# EAGLE design BlinkyBall (EAGLE 7.1.0)
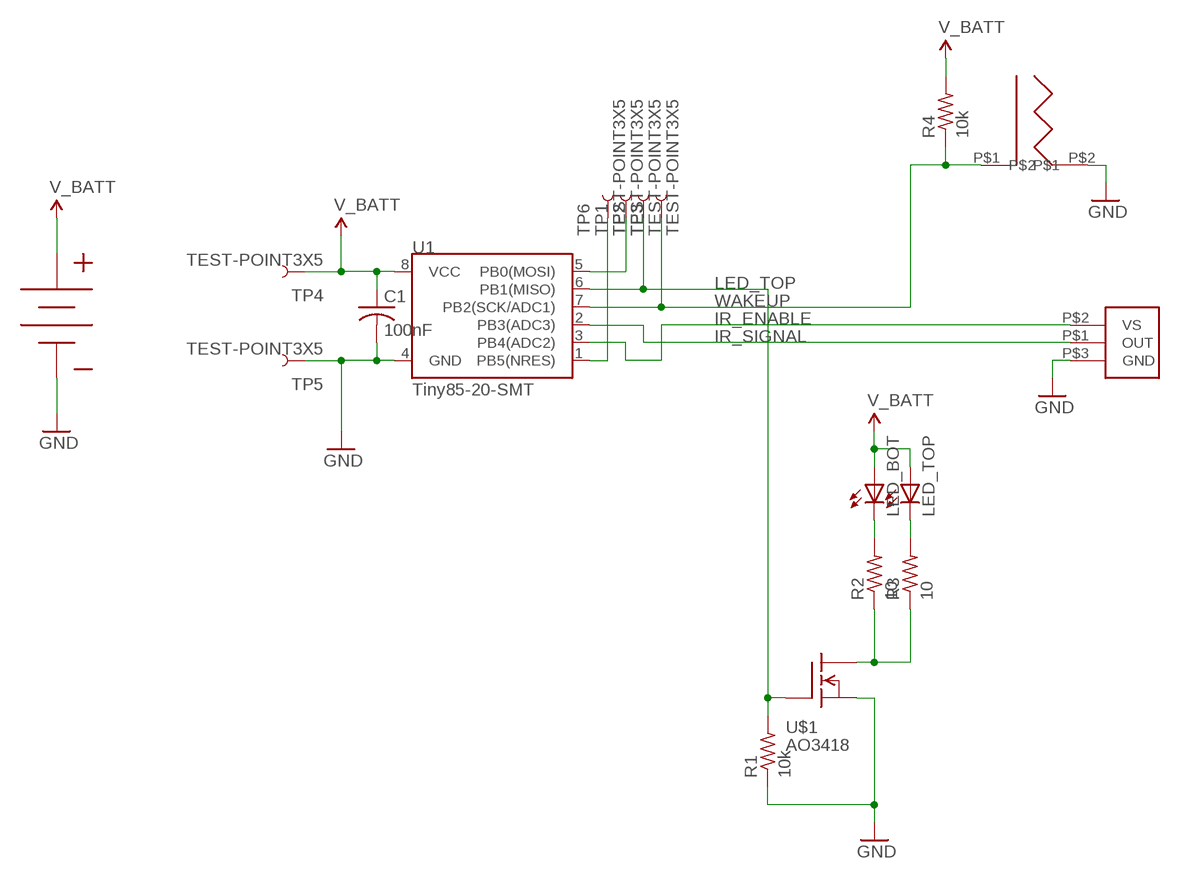
[diagram p0: schematic, sheet 1]

## Parts
C1  100nF  C-USC0603  [C0603]
LED_BOT  LED5MM  [LED5MM]
LED_TOP  LED5MM  [LED5MM]
R1  10k  R-US_R0603  [R0603]
R2  10  R-US_R0603  [R0603]
R3  10  R-US_R0603  [R0603]
R4  10k  R-US_R0603  [R0603]
TP1  TEST-POINT3X5  [PAD.03X.05]
TP2  TEST-POINT3X5  [PAD.03X.05]
TP3  TEST-POINT3X5  [PAD.03X.05]
TP4  TEST-POINT3X5  [PAD.03X.05]
TP5  TEST-POINT3X5  [PAD.03X.05]
TP6  TEST-POINT3X5  [PAD.03X.05]
U1  Tiny85-20-SMT  ATTINY45TINY85-20-SMT  [SO08-EIAJ]
U$1  AO3418  N_MOSFETSOT23  [SOT23]
U$2  BATTERY_BUTTON_CELLAG3  [BATTERY_COVER_AG3]
U$3  SW-18015P  [SW-18015P]
U$5  TSOP321  [TSOP321]

## Nets
GND: C1.2 R1.1 TP5.P$1 U1.4(GND) U$1.2(S) U$2.- U$3.P$2 U$5.P$3(GND)
IR_ENABLE: U1.3(PB4(ADC2)) U$5.P$2(VS)
IR_SIGNAL: U1.2(PB3(ADC3)) U$5.P$1(OUT)
LED_TOP: R1.2 TP2.P$1 U1.6(PB1(MISO)) U$1.1(G)
N$2: LED_BOT.K(C) R2.2
N$3: LED_TOP.K(C) R3.2
N$4: R2.1 R3.1 U$1.3(D)
RESET: TP6.P$1 U1.1(PB5(NRES))
V_BATT: C1.1 LED_BOT.A LED_TOP.A R4.2 TP4.P$1 U1.8(VCC) U$2.+1(+) U$2.+2(+) U$2.+3(+) U$2.+4(+)
WAKEUP: R4.1 TP3.P$1 U1.7(PB2(SCK/ADC1)) U$3.P$1
YYYYY: TP1.P$1 U1.5(PB0(MOSI))

## Library data of the parts
C1 = adafruit:C-US: CAPACITOR, American symbol
LED_BOT LED_TOP = adafruit:LED: LED OSRAM: - CHIPLED LG R971, LG N971, LY N971, LG Q971, LY Q971, LO R971, LY R971 LH N974, LH R974 LS Q976, LO Q976, LY Q976 LO Q996 - Hyper CHIPLED LW Q18S LB Q993, LB Q99A, LB R99A - SideLED LS A670, LO A670, LY A670, LG A670, LP A670 LB A673, LV A673, LT A673, LW A673 LH A674 LY A675 LS A676, LA A676, LO A676, LY A676, LW A676 LS A679, LY A679, LG A679 - Hyper Micro SIDELED® LS Y876, LA Y876, LO Y876, LY Y876 LT Y87S - SmartLED LW L88C, LW L88S LB L89C, LB L89S, LG L890 LS L89K, LO L89K, LY L89K LS L896, LA L896, LO L896, LY L896 - TOPLED LS T670, LO T670, LY T670, LG T670, LP T670 LSG T670, LSP T670, LSY T670, LOP T670, LYG T670 LG T671, LOG T671, LSG T671 LB T673, LV T673, LT T673, LW T673 LH T674 LS T676, LA T676, LO T676, LY T676, LB T676, LH T676, LSB T676, LW T676 LB T67C, LV T67C, LT T67C, LS T67K, LO T67K, LY T67K, LW E67C LS E67B, LA E67B, LO E67B, LY E67B, LB E67C, LV E67C, LT E67C LW T67C LS T679, LY T679, LG T679 LS T770, LO T770, LY T770, LG T770, LP T770 LB T773, LV T773, LT T773, LW T773 LH T774 LS E675, LA E675, LY E675, LS T675 LS T776, LA T776, LO T776, LY T776, LB T776 LHGB T686 LT T68C, LB T68C - Hyper Mini TOPLED® LB M676 - Mini TOPLED Santana® LG M470 LS M47K, LO M47K, LY M47K Source: http://www.osram.convergy.de/
R1-R4 = adafruit:R-US_: RESISTOR, American symbol
TP1-TP6 = SparkFun-Passives:TEST-POINT: Bare copper test points for troubleshooting or ICT
U1 = SparkFun-DigitalIC:ATTINY45: Atmel 8-pin 2/4/8kB flash uC; PROD_ID: IC-09092
U$1 = blinkinlabs:N_MOSFET: Generic N channel MOSFET. Check your pinout! Use Value to store the actual chip type.
U$2 = blinkinlabs:BATTERY_BUTTON_CELL
U$3 = blinkinlabs:SW-18015P
U$5 = blinkinlabs:TSOP321

## Board
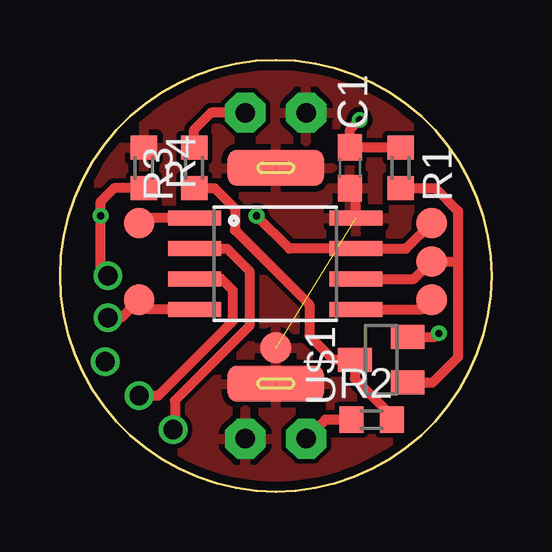
[diagram p1: board, top side]
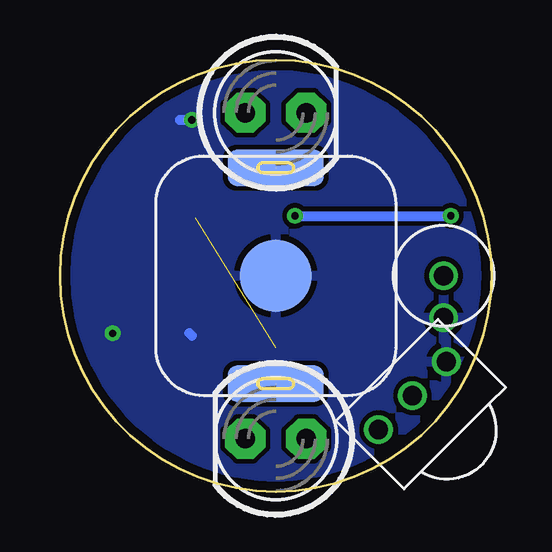
[diagram p2: board, bottom side, seen from below]

Size 18 x 18 mm. Coordinates in mm from the lower left corner, seen from the top.
Outline: 0,9 arc90 9,0 arc90 18,9 arc90 9,18 arc90 0,9
Copper layers (1*16): Top 0.0356mm / dielectric 1.5011mm / Bottom 0.0356mm
Design rules "BlinkyTape *": minimum track width 0.25mm, minimum drill 0.3mm, track to track 0.2mm, track to pad 0.2mm, pad to pad 0.2mm, via to via 0.2mm, smd to smd 0.2mm, copper to edge 15mil, drill to drill 0.25mm, minimum pad ring 7mil, minimum via ring 7mil, stop-mask expansion 2mil, vias tented up to drill 0.35mm, thermal gap 10mil

### Footprints (pad centres in the part's own frame; a part is rotated, then mirrored left to right if it is on the bottom)
C0603 = smd 1.1 x 1: 1 -0.85,0; 2 0.85,0
LED5MM = drill 0.813 pad 1.676 octagon: A -1.27,0; K 1.27,0
R0603 = smd 1 x 1.1: 1 -0.85,0; 2 0.85,0
PAD.03X.05 = smd 1.27 x 1.27: P$1 0,0
SO08-EIAJ = smd 0.61 x 2.21: 1 -1.905,-3.378; 2 -0.635,-3.378; 3 0.635,-3.378; 4 1.905,-3.378; 5 1.905,3.353; 6 0.635,3.353; 7 -0.635,3.353; 8 -1.905,3.353
SOT23 = smd 1 x 1.4: 1 -0.95,-1.1; 2 0.95,-1.1; 3 0,1.1
BATTERY_COVER_AG3 = smd 1.5 x 4: +1 -4.5,0; +2 4.5,0 | smd 1.5 x 4 bottom: +3 -4.5,0; +4 4.5,0 | smd 3 x 3: - 0,0
SW-18015P = drill 0.8: P$1 0,0; P$2 1.75,0
TSOP321 = drill 0.8: P$1 -2,0; P$2 0,0; P$3 2,0

### Placement (x,y rotation side)
C1  12.1,13.5 90 top
LED_BOT  9,2.2 180 bottom
LED_TOP  9,15.8 0 bottom
R1  14.2,13.5 270 top
R2  13,3 180 top
R3  5.6,13.5 90 top
R4  3.5,13.5 90 top
TP1  15.5,8 0 top
TP2  15.5,9.6 0 top
TP3  15.5,11.2 0 top
TP4  9,6 0 top
TP5  3.3,8 0 top
TP6  3.3,11.2 0 top
U1  9,9.5 270 top
U$1  13.4,5.5 90 top
U$2  9,9 270 bottom
U$3  2,9 270 bottom
U$5  3.3,4 45 bottom

### Tracks (layer width: path | path; a pad name or v marks a point on that pad's centre or on a via)
GND  (via drill 0.3)
  Top 0.406: U$1.2 15.65,6.45 v15.8,6.6 | R1.1 C1.2 12.1,15.1 v12.5,15.5 | U1.4 3.71,7.59 TP5.P$1 2.55,7.25 U$3.P$2
  Bottom 0.406: 12.6,6.6 12.5,6.5 | v12.5,15.5 13,15.5
  pour Bottom: 0,0 18,0 18,18 0,18
IR_ENABLE
  Top 0.406: U1.3 6.74,8.87 7.2,8.4 7.2,7.1 4.1,4 U$5.P$2
IR_SIGNAL
  Top 0.406: U1.2 6.96,10.13 7.9,9.2 7.9,6.9 4.8,3.8 4.8,2.67 U$5.P$1
LED_TOP
  Top 0.406: U$1.1 15.55,4.55 16.6,5.6 16.6,9.6 | U1.6 14.77,8.87 TP2.P$1 16.6,9.6 | R1.2 15.65,12.65 16.6,11.7 16.6,9.6
N$2
  Top 0.406: R2.2 11.07,3 LED_BOT.K
N$3
  Top 0.406: LED_TOP.K 6.3,15.8 5.6,15.1 R3.2
N$4
  Top 0.406: R2.1 13.85,3.15 12.3,4.7 U$1.3 11.4,5.5 10.4,6.5 10.4,7.8 7.3,10.9 7.3,11.8 6.45,12.65 R3.1
RESET
  Top 0.406: U1.1 3.5,11.4 TP6.P$1
V_BATT  (3 unrouted)
  Top 0.406: U1.8 12.35,12.4 C1.1
  pour Top: 0,18 18,18 18,0 0,0
WAKEUP  (via drill 0.3)
  Top 0.406: v8.2,11.5 9.56,10.13 U1.7 14.44,10.13 TP3.P$1 | R4.1 2.25,12.65 1.7,12.1 v1.7,11.5 1.7,9.3 U$3.P$1
  Bottom 0.406: v8.2,11.5 v1.7,11.5
YYYYY
  Top 0.406: U1.5 15.1,7.59 TP1.P$1

### Text on the board
tPlace: BlinkyBall / by Blinkinlabs | RevA / 2015/1